# EasyEDA schematic SCH_ea-powerplant_2025-10-05.json
TITLE: Sheet_1; REV: 1.0; Date: 2025-06-16; Sheet: 1/1; Drawn By: Jirka Svítil; Company: Your Company
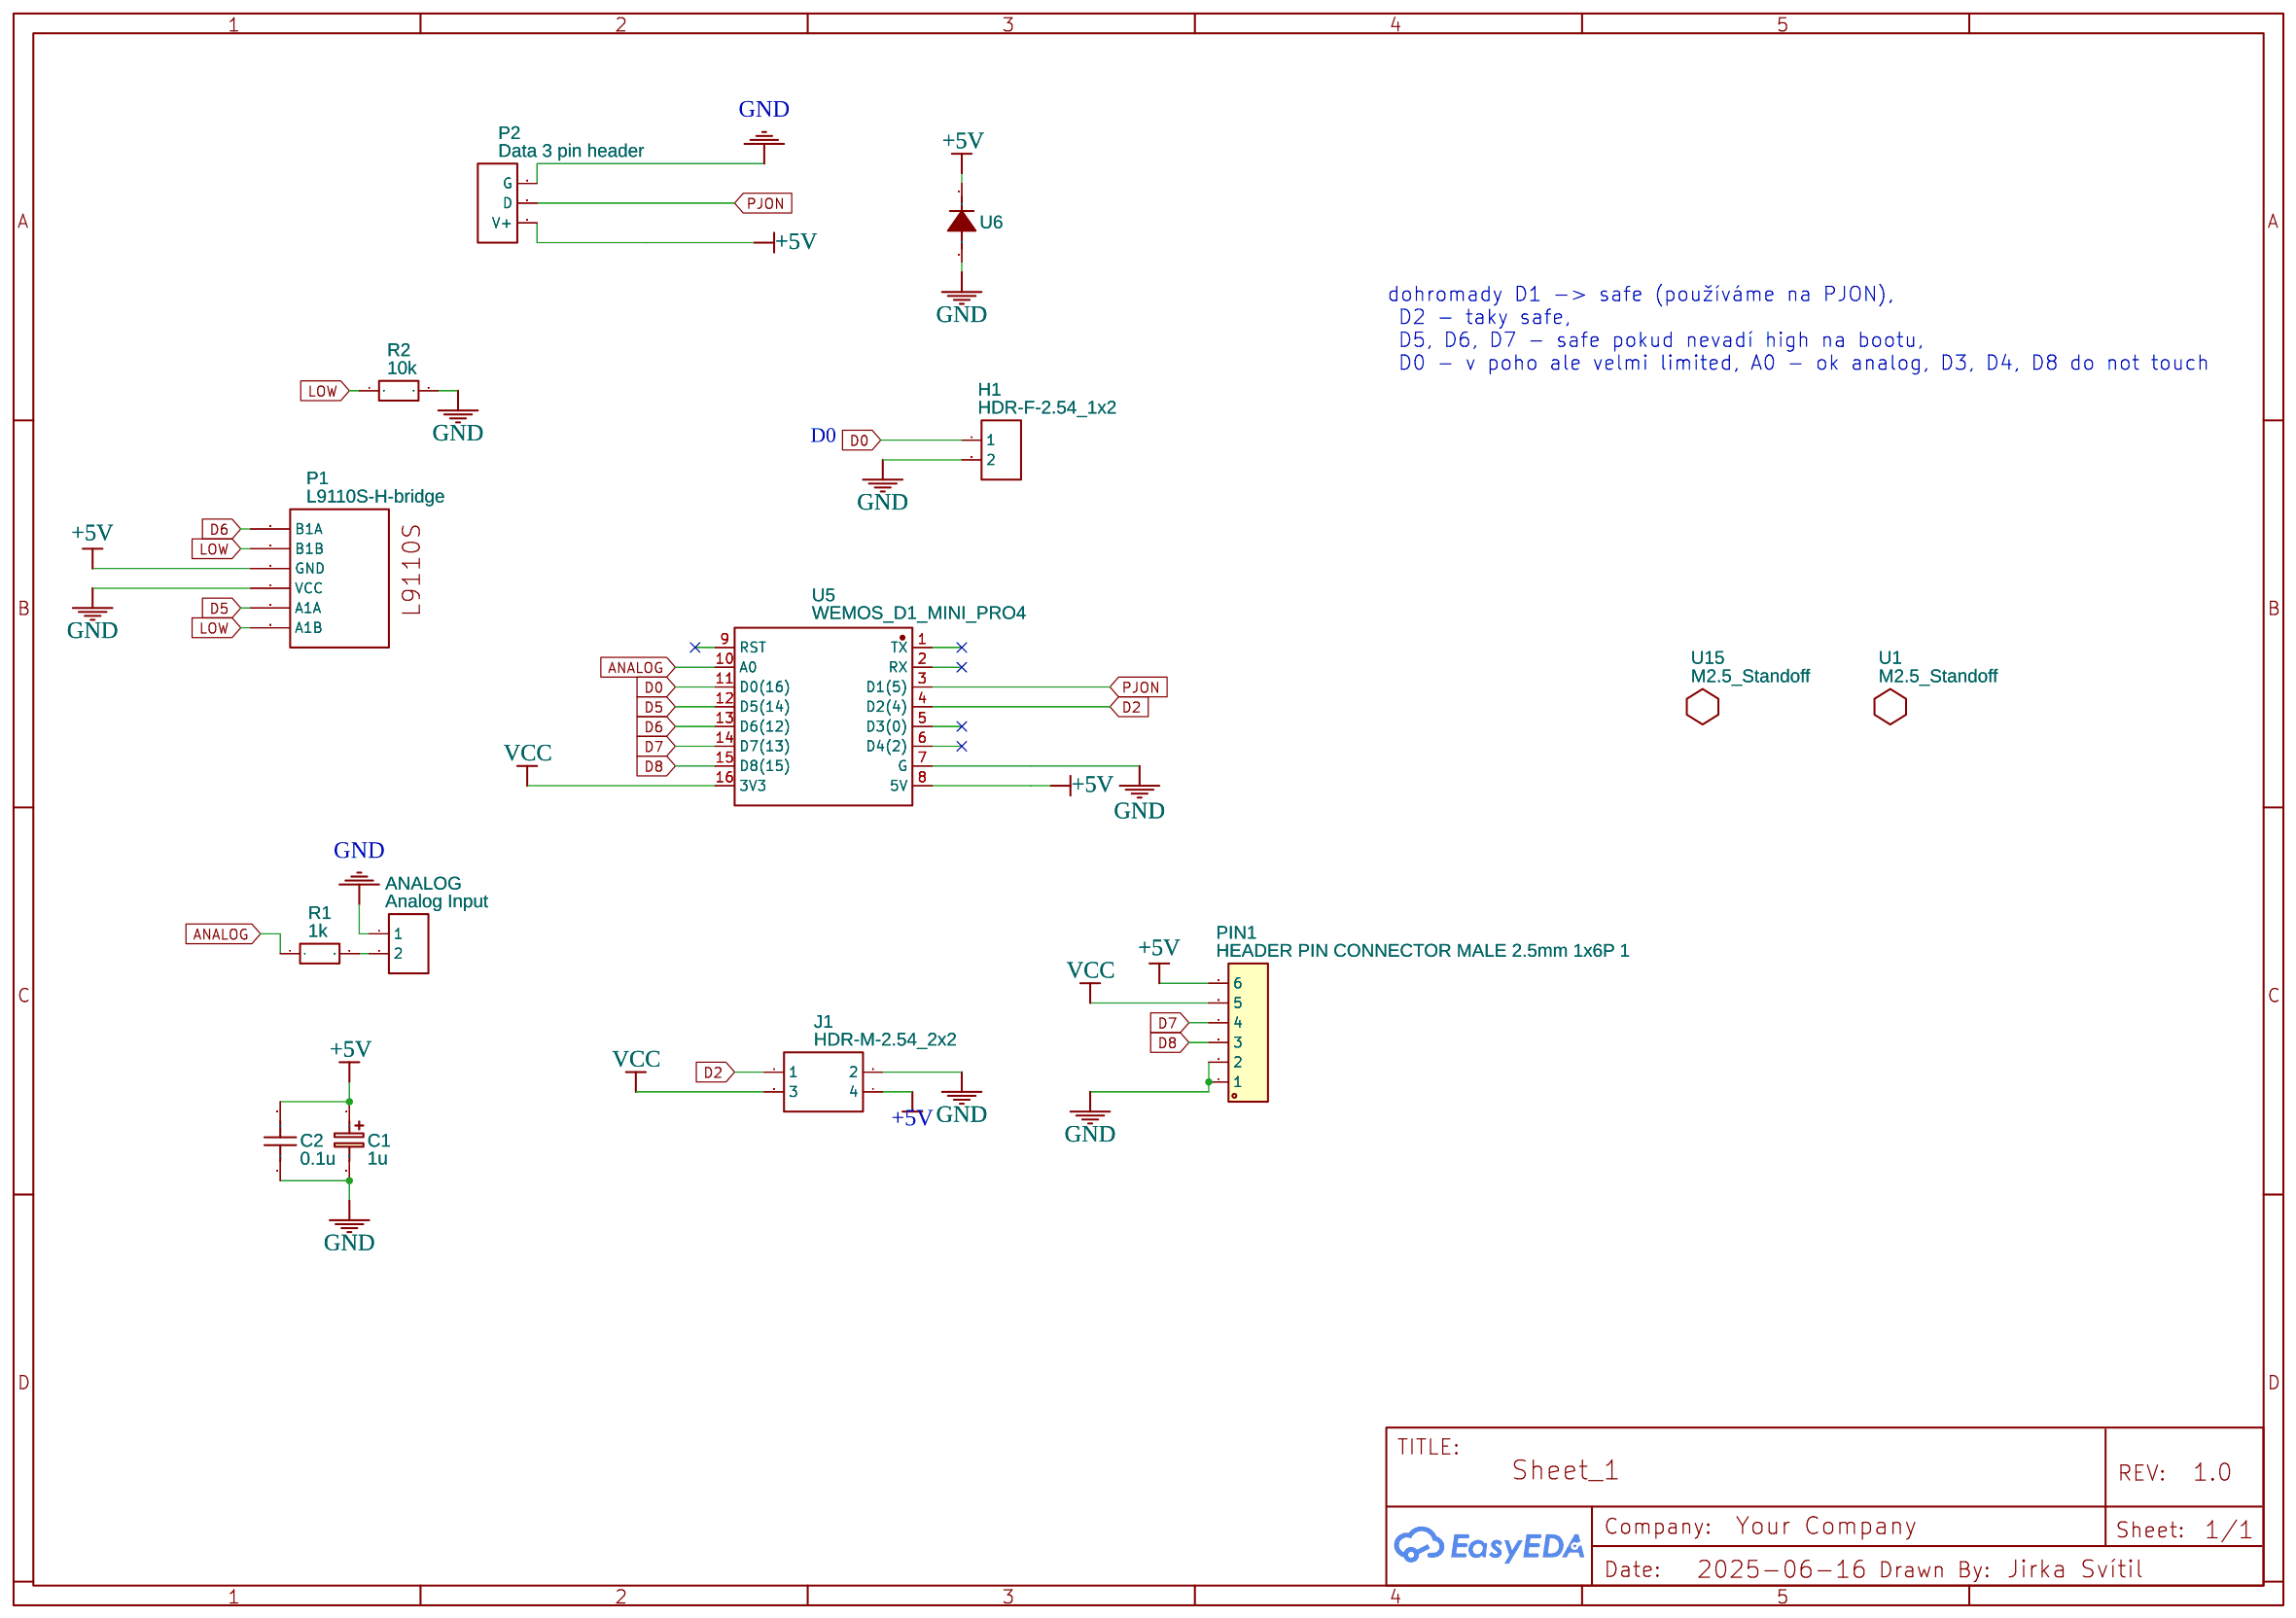
[diagram p0: schematic sheet]

## Parts
ANALOG  Analog Input  [HDR-F-2.54_1X2]
C1  1u  [CASE-A_3216]
C2  0.1u  [C0603]
H1  HDR-F-2.54_1x2  [HDR-F-2.54_1X2]
J1  HDR-M-2.54_2x2  [HDR-M-2.54_2X2]
P1  L9110S-H-bridge  [SOCKET FOR L9110S-H-BRIDGE-STEPPER-MOTOR-DUAL-DC-MOTOR-DRIVER-CONTROLLER-MODULE]
P2  Data 3 pin header  [DATA 3 PIN HEADER]
PIN1  HEADER PIN CONNECTOR MALE 2.5mm 1x6P 1  [HEADER PIN CONNECTOR MALE 2.5MM 1X6P LAYOUT 1]
R1  1k  [R0603]
R2  10k  [R0603]
U1  M2.5_Standoff  [M2.5_STANDOFF]
U5  WEMOS_D1_MINI_PRO4  [DIP-16_WEMOS_D1_MINI_PRO4]
U6  S3M_C4154420  [SMA_L4.4-W2.5-LS5.0-RD]
U15  M2.5_Standoff  [M2.5_STANDOFF]

## Library data of the parts
ANALOG H1 = HDR-F-2.54_1x2: Supplier Part: C49661; Supplier: LCSC; Contributor: LCEDA_Lib
C1 = C_Tan_SMD_A_EU: Contributor: LCEDA_Lib; Supplier Part: C7187; Supplier: LCSC
C2 = C_0603_US: Supplier Part: C14663; Supplier: LCSC; Contributor: LCEDA_Lib
J1 = HDR-M-2.54_2x2: Supplier Part: C66690; Supplier: LCSC; Contributor: LCEDA_Lib
P1 = Socket for L9110S-H-bridge-Stepper-Motor-Dual-DC-Motor-Driver-Controller-Module: Supplier Part: C37208; Supplier: LCSC; Manufacturer: BOOMELE; Manufacturer Part: Header-Male-2.54_1x6
P2 = Data 3 pin header: Supplier Part: C146243; Supplier: LCSC; Manufacturer: Boom Precision Elec; Manufacturer Part: Header-Female-2.54_1x3; link: https://datasheet.lcsc.com/szlcsc/Boom-Precision-Elec-2-54mm-1-8P-Straight-Female-header_C27438.pdf; Contributor: theouiqdmw
PIN1 = HEADER PIN CONNECTOR MALE 2.5mm 1x6P 1: Contributor: phatcomp_it
R1 = R_0603_EU: Supplier Part: C21190; Supplier: LCSC; Contributor: LCEDA_Lib
R2 = R_0603_EU: Supplier Part: C2930027; Supplier: LCSC; Contributor: LCEDA_Lib
U1 U15 = M2.5_Standoff: Contributor: michael_6605
U5 = WEMOS_D1_MINI_PRO4: Contributor: LCSC; Supplier: LCSC; Supplier Part: C2837266; Manufacturer: null; Manufacturer Part: Wemos_D1_mini_Pro4; JLCPCB Part Class: Extended Part
U6 = S3M_C4154420: Contributor: lcsc; Supplier: LCSC; Supplier Part: C4154420; Manufacturer: TWGMC(台湾迪嘉); Manufacturer Part: S3M; JLCPCB Part Class: Extended Part

## Nets
+5V: C1.1 C2.2 J1.4 P1.3(GND) P2.1(V+) PIN1.6 U5.8(5V) U6.1
GND: ANALOG.1 C1.2 C2.1 H1.2 J1.2 P1.4(VCC) P2.3(G) PIN1.1 PIN1.2 R2.2 U5.7(G) U6.2
VCC: J1.3 PIN1.5 U5.16(3V3)
ANALOG: R1.1 U5.10(A0)
D0: H1.1 U5.11(D0(16))
D2: J1.1 U5.4(D2(4))
D5: P1.5(A1A) U5.12(D5(14))
D6: P1.1(B1A) U5.13(D6(12))
D7: PIN1.4 U5.14(D7(13))
D8: PIN1.3 U5.15(D8(15))
LOW: P1.2(B1B) P1.6(A1B) R2.1
PJON: P2.2(D) U5.3(D1(5))
Net-(ANALOG-2): ANALOG.2 R1.2

Not connected (* = marked no-connect by the designer): U5 1(TX) 2(RX) 5(D3(0)) 6(D4(2)) 9(RST)

## Notes on the sheet
- dohromady D1 -> safe (používáme na PJON),
   D2 - taky safe,
   D5, D6, D7 - safe pokud nevadí high na bootu,
   D0 - v poho ale velmi limited, A0 - ok analog, D3, D4, D8 do not touch
- D0
